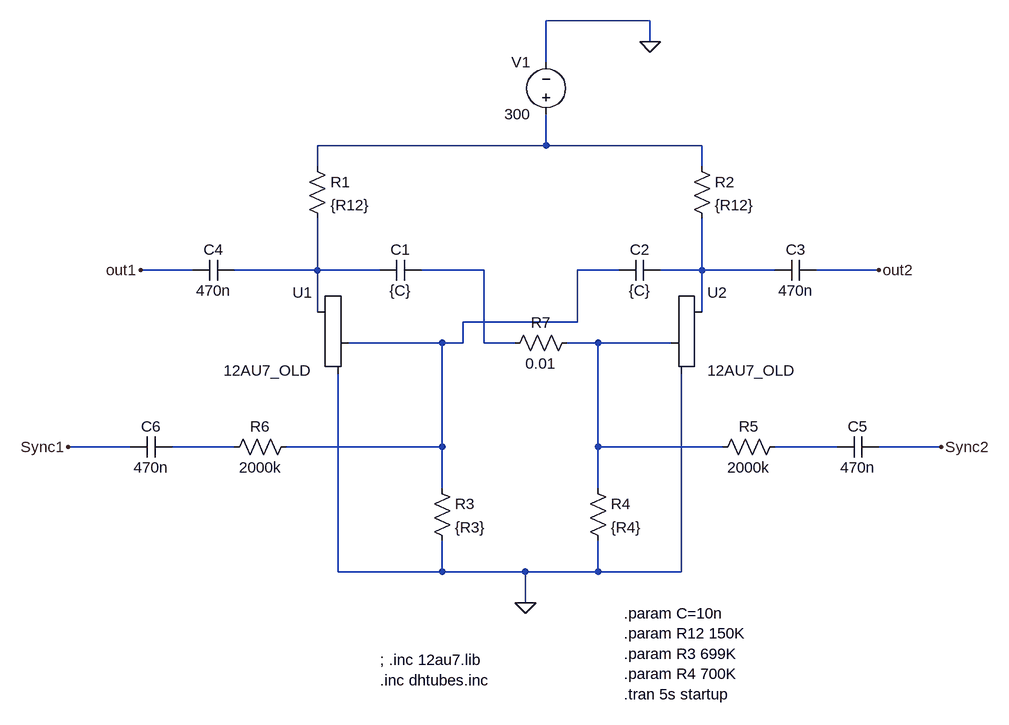
[diagram p0: schematic Multivibrator1.asc]
Multivibrator1.asc, the LTspice schematic file:
Version 4
SHEET 1 1296 768
WIRE 656 -272 496 -272
WIRE 656 -240 656 -272
WIRE 496 -208 496 -272
WIRE 496 -80 496 -128
WIRE 496 -80 144 -80
WIRE 736 -80 496 -80
WIRE 144 -48 144 -80
WIRE 736 -48 736 -80
WIRE -48 112 -128 112
WIRE 144 112 144 32
WIRE 144 112 16 112
WIRE 240 112 144 112
WIRE 400 112 304 112
WIRE 608 112 544 112
WIRE 736 112 736 32
WIRE 736 112 672 112
WIRE 848 112 736 112
WIRE 1008 112 912 112
WIRE 144 176 144 112
WIRE 736 176 736 112
WIRE 544 192 544 112
WIRE 544 192 368 192
WIRE 336 224 192 224
WIRE 368 224 368 192
WIRE 368 224 336 224
WIRE 400 224 400 112
WIRE 448 224 400 224
WIRE 576 224 528 224
WIRE 688 224 576 224
WIRE -144 384 -240 384
WIRE 16 384 -80 384
WIRE 336 384 336 224
WIRE 336 384 96 384
WIRE 576 384 576 224
WIRE 768 384 576 384
WIRE 944 384 848 384
WIRE 1104 384 1008 384
WIRE 336 448 336 384
WIRE 576 448 576 384
WIRE 176 576 176 272
WIRE 336 576 336 528
WIRE 336 576 176 576
WIRE 464 576 336 576
WIRE 576 576 576 528
WIRE 576 576 464 576
WIRE 704 576 704 272
WIRE 704 576 576 576
WIRE 464 624 464 576
FLAG 464 624 0
FLAG 656 -240 0
FLAG -128 112 out1
FLAG 1008 112 out2
FLAG 1104 384 Sync2
FLAG -240 384 Sync1
SYMBOL voltage 496 -112 R180
WINDOW 0 24 96 Left 2
WINDOW 3 24 16 Left 2
WINDOW 123 0 0 Left 0
WINDOW 39 0 0 Left 0
SYMATTR InstName V1
SYMATTR Value 300
SYMBOL Misc\\triode 144 224 M0
SYMATTR InstName U1
SYMATTR SpiceModel 12AU7_OLD
SYMATTR Value 12AU7_OLD
SYMBOL Misc\\triode 736 224 R0
SYMATTR InstName U2
SYMATTR SpiceModel 12AU7_OLD
SYMATTR Value 12AU7_OLD
SYMBOL res 128 -64 R0
SYMATTR InstName R1
SYMATTR Value {R12}
SYMBOL res 720 -64 R0
SYMATTR InstName R2
SYMATTR Value {R12}
SYMBOL cap 304 96 R90
WINDOW 0 0 32 VBottom 2
WINDOW 3 32 32 VTop 2
SYMATTR InstName C1
SYMATTR Value {C}
SYMATTR SpiceLine V=400
SYMBOL cap 672 96 R90
WINDOW 0 0 32 VBottom 2
WINDOW 3 32 32 VTop 2
SYMATTR InstName C2
SYMATTR Value {C}
SYMATTR SpiceLine V=400
SYMBOL res 320 432 R0
SYMATTR InstName R3
SYMATTR Value {R3}
SYMBOL res 560 432 R0
SYMATTR InstName R4
SYMATTR Value {R4}
SYMBOL cap 912 96 R90
WINDOW 0 0 32 VBottom 2
WINDOW 3 32 32 VTop 2
SYMATTR InstName C3
SYMATTR Value 470n
SYMBOL cap 16 96 R90
WINDOW 0 0 32 VBottom 2
WINDOW 3 32 32 VTop 2
SYMATTR InstName C4
SYMATTR Value 470n
SYMBOL res 864 368 R90
WINDOW 0 0 56 VBottom 2
WINDOW 3 32 56 VTop 2
SYMATTR InstName R5
SYMATTR Value 2000k
SYMBOL cap 1008 368 R90
WINDOW 0 0 32 VBottom 2
WINDOW 3 32 32 VTop 2
SYMATTR InstName C5
SYMATTR Value 470n
SYMBOL res 112 368 R90
WINDOW 0 0 56 VBottom 2
WINDOW 3 32 56 VTop 2
SYMATTR InstName R6
SYMATTR Value 2000k
SYMBOL cap -80 368 R90
WINDOW 0 0 32 VBottom 2
WINDOW 3 32 32 VTop 2
SYMATTR InstName C6
SYMATTR Value 470n
SYMBOL res 544 208 R90
WINDOW 0 0 56 VBottom 2
WINDOW 3 32 56 VTop 2
SYMATTR InstName R7
SYMATTR Value 0.01
TEXT 616 640 Left 2 !.param C=10n\n.param R12 150K\n.param R3 699K\n.param R4 700K\n.tran 5s startup
TEXT 240 712 Left 2 !; .inc 12au7.lib\n.inc dhtubes.inc

The netlist it stands for:
* Multivibrator1.asc
V1 N001 0 300
XU1 N002 N004 0 12AU7_OLD 12AU7_OLD
XU2 N005 N006 0 12AU7_OLD 12AU7_OLD
R1 N001 N002 {R12}
R2 N001 N005 {R12}
C1 N003 N002 {C} V=400
C2 N005 N004 {C} V=400
R3 N004 0 {R3}
R4 N006 0 {R4}
C3 out2 N005 470n
C4 N002 out1 470n
R5 N008 N006 2000k
C5 Sync2 N008 470n
R6 N004 N007 2000k
C6 N007 Sync1 470n
R7 N006 N003 0.01
.param C=10n
.param R12 150K
.param R3 699K
.param R4 700K
.tran 5s startup
; .inc 12au7.lib
.inc dhtubes.inc
.backanno
.end